# EAGLE board video-max5 (EAGLE 5.11)
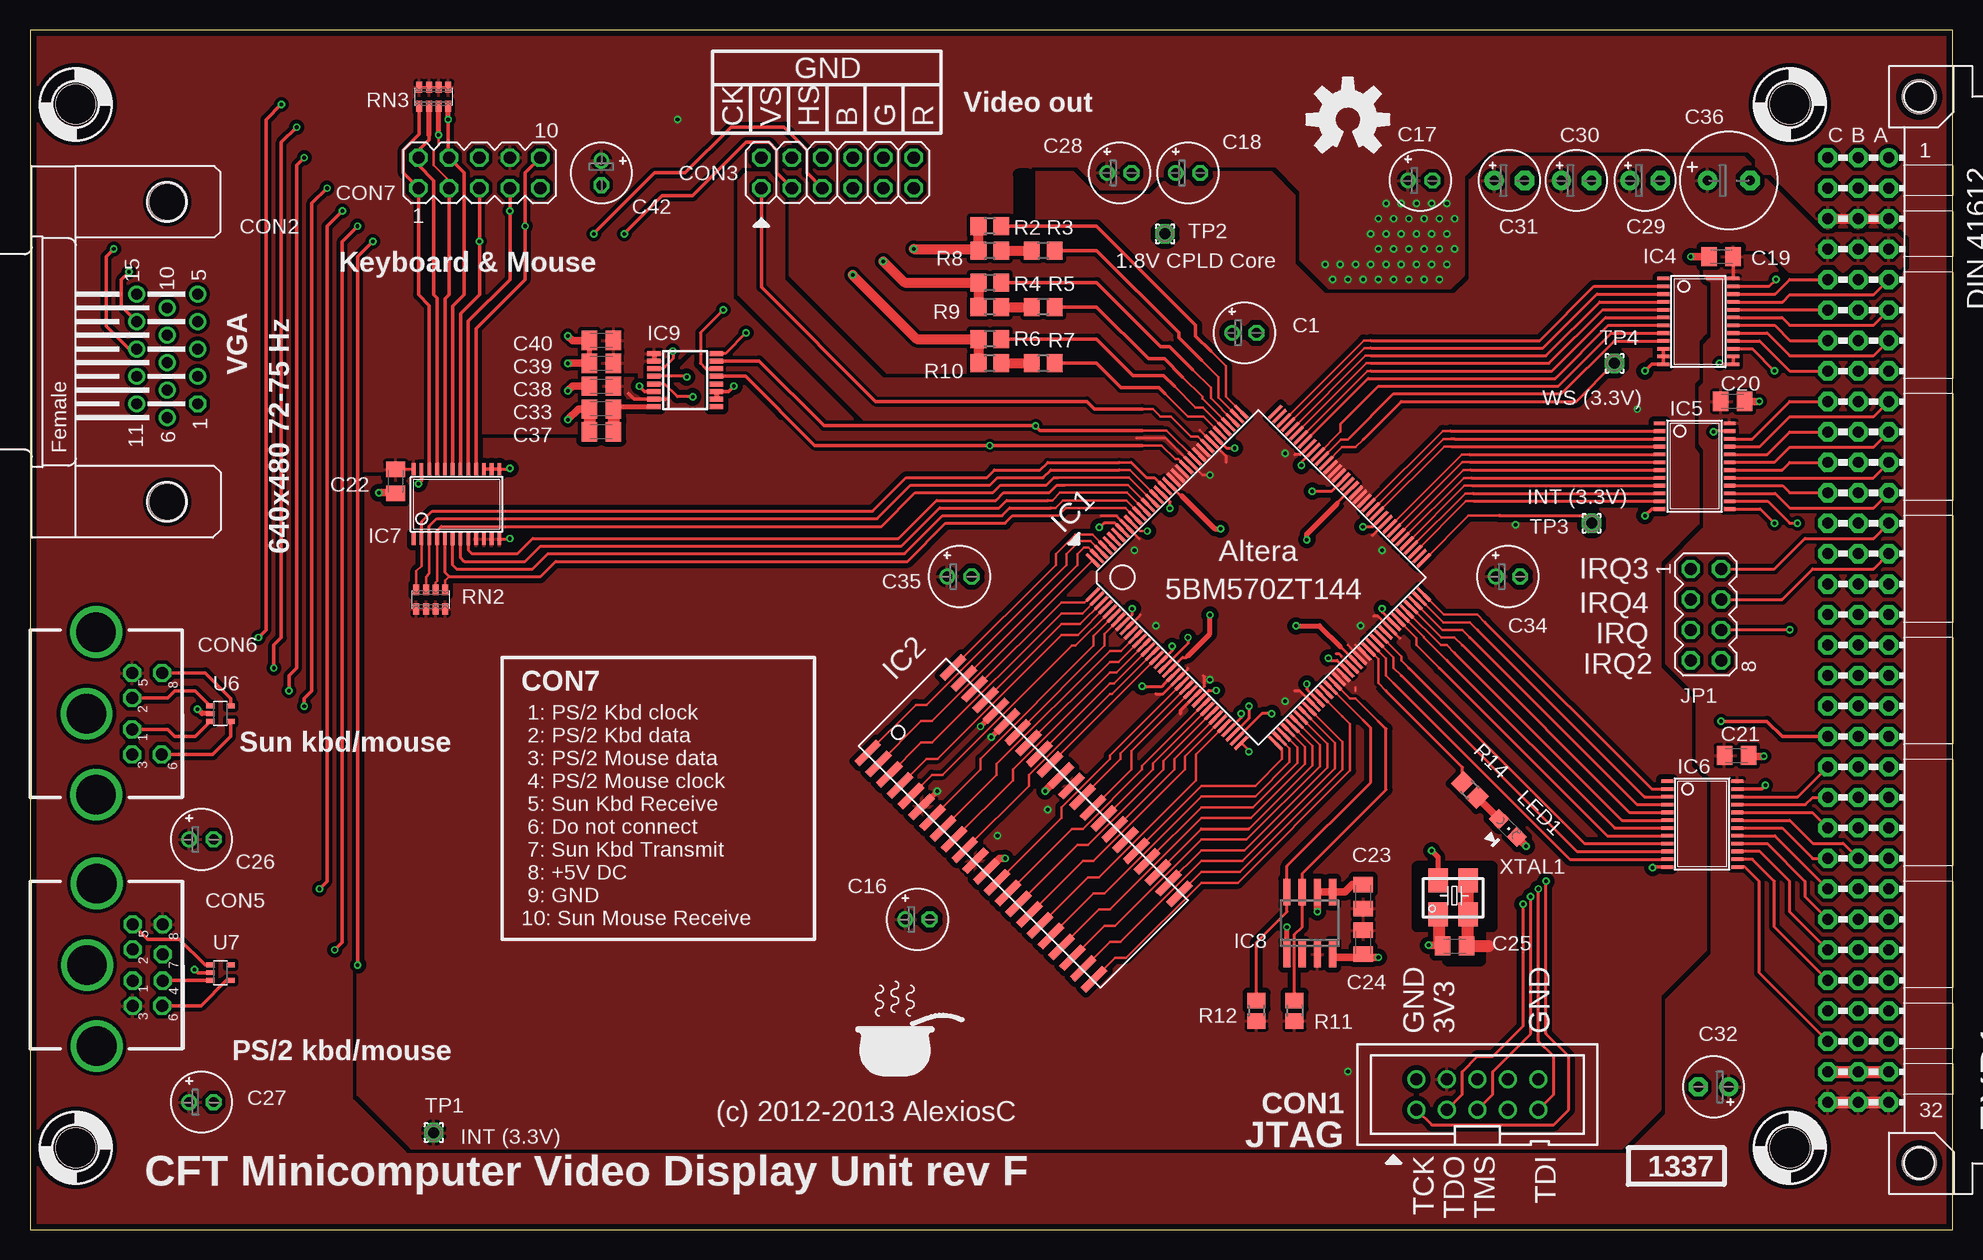
[diagram p5: board, top side]
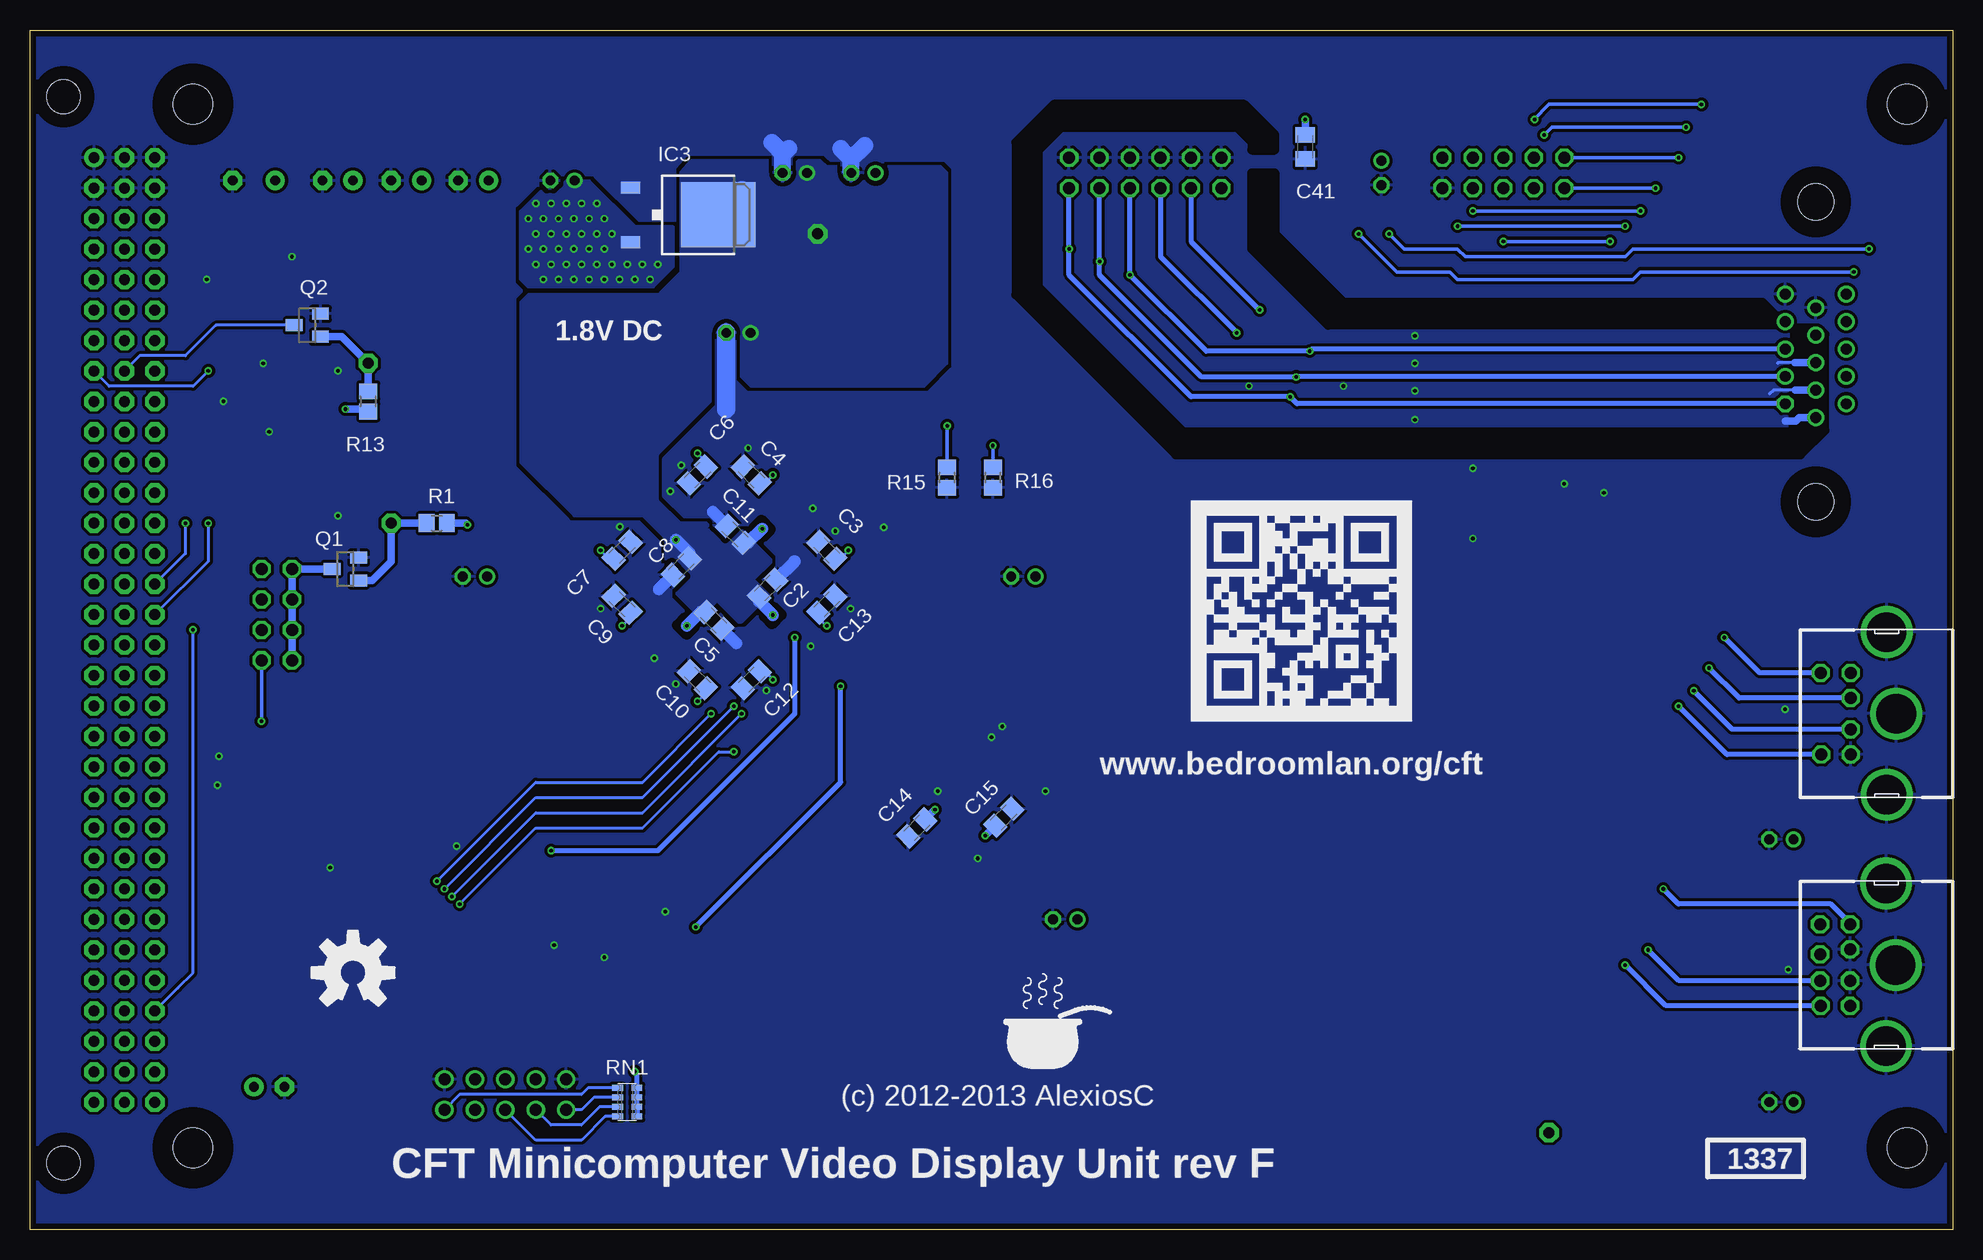
[diagram p6: board, bottom side, seen from below]

Size 160.27 x 100.03 mm. Coordinates in mm from the lower left corner, seen from the top.
Copper layers (1*16): Top 0.035mm / dielectric 1.5mm / Bottom 0.035mm
Design rules "smart-prototyping *": minimum track width 7mil, minimum drill 12mil, track to track 5mil, track to pad 5mil, pad to pad 5mil, via to via 5mil, smd to smd 0mil, copper to edge 20mil, drill to drill 10mil, minimum pad ring 10mil, minimum via ring 6mil, stop-mask expansion 2mil, vias tented up to drill 25mil, thermal gap 10mil
Net classes: 0 default: width 0.254 mm, clearance 0.152 mm; 1 low power: width 1.27 mm, clearance 0.203 mm; 2 Power Rail: width 0.61 mm, clearance 0.254 mm; 3 3.3V power: width 0.61 mm, clearance 0.203 mm; 4 Analogue: width 0.406 mm, clearance 0.203 mm
tRestrict: area 115.6,25.2 to 121.6,30; area 118.1,22.4 to 121,26.2; area 115.6,25.6 to 121.6,30.3; area 115.9,25.2 to 121.9,30; area 115.9,25.6 to 121.9,30.3; area 82.4,84.4 to 83.2,88
bRestrict: area 14,75.4 to 58.4,88.1; area 10.7,64.6 to 78.1,93.8; area 98.6,57.8 to 99.9,59.2; area 104.9,49.6 to 106.3,51; area 97.7,50.5 to 99.1,51.9

## Footprints (pad centres in the part's own frame; a part is rotated, then mirrored left to right if it is on the bottom)
E2-5 = drill 0.813 pad 1.27 round: + -1.016,0 | drill 0.813 pad 1.27 octagon: - 1.016,0
C0805K = smd 1.3 x 1.6: 1 -1,0; 2 1,0
E2,5-5 = drill 0.813 pad 1.6 round: + -1.27,0 | drill 0.813 pad 1.6 octagon: - 1.27,0
E3,5-8 = drill 0.813 pad 1.6 round: + -1.778,0 | drill 0.813 pad 1.6 octagon: - 1.778,0
SHROUDED-HEADER-2X5-2.5MM = drill 1 pad 1.422 round: 1 -5.08,-1.27; 2 -5.08,1.27; 3 -2.54,-1.27; 4 -2.54,1.27; 5 0,-1.27; 6 0,1.27; 7 2.54,-1.27; 8 2.54,1.27; 9 5.08,-1.27; 10 5.08,1.27
HDF15H = drill 0.9 octagon: 1 4.329,2.54 | drill 0.9 round: 2 2.043,2.54; 3 -0.243,2.54; 4 -2.529,2.54; 5 -4.815,2.54; 6 5.472,0; 7 3.186,0; 8 0.9,0; 9 -1.386,0; 10 -3.672,0; 11 4.329,-2.54; 12 2.043,-2.54; 13 -0.243,-2.54; 14 -2.529,-2.54; 15 -4.815,-2.54 | hole 3: -12.5,0; 12.5,0
2X06 = drill 1.016 octagon: 1 -6.35,-1.27; 2 -6.35,1.27; 3 -3.81,-1.27; 4 -3.81,1.27; 5 -1.27,-1.27; 6 -1.27,1.27; 7 1.27,-1.27; 8 1.27,1.27; 9 3.81,-1.27; 10 3.81,1.27; 11 6.35,-1.27; 12 6.35,1.27
M_DIN8 = drill 1 pad 1.422 octagon: 1 -1.3,-3.8; 2 1.3,-3.8; 3 -3.4,-3.8; 4 -1.3,-6.3; 5 3.4,-3.8; 6 -3.4,-6.25; 7 0.9,-6.3; 8 3.4,-6.3 | drill 3.3 pad 3.5 round: SH1 6.8,-0.8; SH2 0,0; SH3 -6.75,-0.8
M_DIN6 = drill 1 pad 1.422 octagon: 1 -1.3,-3.75; 2 1.3,-3.75; 3 -3.4,-3.75; 5 3.4,-3.75; 6 -3.4,-6.2; 8 3.4,-6.25 | drill 3.3 pad 3.5 round: SH1 6.8,-0.75; SH2 0,0.05; SH3 -6.75,-0.75
MA05-2 = drill 1.016 octagon: 1 -5.08,-1.27; 2 -5.08,1.27; 3 -2.54,-1.27; 4 -2.54,1.27; 5 0,-1.27; 6 0,1.27; 7 2.54,-1.27; 8 2.54,1.27; 9 5.08,-1.27; 10 5.08,1.27
VG96K = drill 0.914 pad 1.6 round: A1 154.94,39.37 | drill 0.914 pad 1.6 octagon: A2 154.94,36.83; A3 154.94,34.29; A4 154.94,31.75; A5 154.94,29.21; A6 154.94,26.67; A7 154.94,24.13; A8 154.94,21.59; A9 154.94,19.05; A10 154.94,16.51; A11 154.94,13.97; A12 154.94,11.43; A13 154.94,8.89; A14 154.94,6.35; A15 154.94,3.81; A16 154.94,1.27; A17 154.94,-1.27; A18 154.94,-3.81; A19 154.94,-6.35; A20 154.94,-8.89; A21 154.94,-11.43; A22 154.94,-13.97; A23 154.94,-16.51; A24 154.94,-19.05; A25 154.94,-21.59; A26 154.94,-24.13; A27 154.94,-26.67; A28 154.94,-29.21; A29 154.94,-31.75; A30 154.94,-34.29; A31 154.94,-36.83; A32 154.94,-39.37; B1 152.4,39.37; B2 152.4,36.83; B3 152.4,34.29; B4 152.4,31.75; B5 152.4,29.21; B6 152.4,26.67; B7 152.4,24.13; B8 152.4,21.59; B9 152.4,19.05; B10 152.4,16.51; B11 152.4,13.97; B12 152.4,11.43; B13 152.4,8.89; B14 152.4,6.35; B15 152.4,3.81; B16 152.4,1.27; B17 152.4,-1.27; B18 152.4,-3.81; B19 152.4,-6.35; B20 152.4,-8.89; B21 152.4,-11.43; B22 152.4,-13.97; B23 152.4,-16.51; B24 152.4,-19.05; B25 152.4,-21.59; B26 152.4,-24.13; B27 152.4,-26.67; B28 152.4,-29.21; B29 152.4,-31.75; B30 152.4,-34.29; B31 152.4,-36.83; B32 152.4,-39.37; C1 149.86,39.37; C2 149.86,36.83; C3 149.86,34.29; C4 149.86,31.75; C5 149.86,29.21; C6 149.86,26.67; C7 149.86,24.13; C8 149.86,21.59; C9 149.86,19.05; C10 149.86,16.51; C11 149.86,13.97; C12 149.86,11.43; C13 149.86,8.89; C14 149.86,6.35; C15 149.86,3.81; C16 149.86,1.27; C17 149.86,-1.27; C18 149.86,-3.81; C19 149.86,-6.35; C20 149.86,-8.89; C21 149.86,-11.43; C22 149.86,-13.97; C23 149.86,-16.51; C24 149.86,-19.05; C25 149.86,-21.59; C26 149.86,-24.13; C27 149.86,-26.67; C28 149.86,-29.21; C29 149.86,-31.75; C30 149.86,-34.29; C31 149.86,-36.83; C32 149.86,-39.37 | hole 2.794: 157.48,44.45; 157.48,-44.45
TQFP144 = smd 0.27 x 1.5: 1 -8.75,-10.75; 2 -8.25,-10.75; 3 -7.75,-10.75; 4 -7.25,-10.75; 5 -6.75,-10.75; 6 -6.25,-10.75; 7 -5.75,-10.75; 8 -5.25,-10.75; 9 -4.75,-10.75; 10 -4.25,-10.75; 11 -3.75,-10.75; 12 -3.25,-10.75; 13 -2.75,-10.75; 14 -2.25,-10.75; 15 -1.75,-10.75; 16 -1.25,-10.75; 17 -0.75,-10.75; 18 -0.25,-10.75; 19 0.25,-10.75; 20 0.75,-10.75; 21 1.25,-10.75; 22 1.75,-10.75; 23 2.25,-10.75; 24 2.75,-10.75; 25 3.25,-10.75; 26 3.75,-10.75; 27 4.25,-10.75; 28 4.75,-10.75; 29 5.25,-10.75; 30 5.75,-10.75; 31 6.25,-10.75; 32 6.75,-10.75; 33 7.25,-10.75; 34 7.75,-10.75; 35 8.25,-10.75; 36 8.75,-10.75; 73 8.75,10.75; 74 8.25,10.75; 75 7.75,10.75; 76 7.25,10.75; 77 6.75,10.75; 78 6.25,10.75; 79 5.75,10.75; 80 5.25,10.75; 81 4.75,10.75; 82 4.25,10.75; 83 3.75,10.75; 84 3.25,10.75; 85 2.75,10.75; 86 2.25,10.75; 87 1.75,10.75; 88 1.25,10.75; 89 0.75,10.75; 90 0.25,10.75; 91 -0.25,10.75; 92 -0.75,10.75; 93 -1.25,10.75; 94 -1.75,10.75; 95 -2.25,10.75; 96 -2.75,10.75; 97 -3.25,10.75; 98 -3.75,10.75; 99 -4.25,10.75; 100 -4.75,10.75; 101 -5.25,10.75; 102 -5.75,10.75; 103 -6.25,10.75; 104 -6.75,10.75; 105 -7.25,10.75; 106 -7.75,10.75; 107 -8.25,10.75; 108 -8.75,10.75 | smd 1.5 x 0.27: 37 10.75,-8.75; 38 10.75,-8.25; 39 10.75,-7.75; 40 10.75,-7.25; 41 10.75,-6.75; 42 10.75,-6.25; 43 10.75,-5.75; 44 10.75,-5.25; 45 10.75,-4.75; 46 10.75,-4.25; 47 10.75,-3.75; 48 10.75,-3.25; 49 10.75,-2.75; 50 10.75,-2.25; 51 10.75,-1.75; 52 10.75,-1.25; 53 10.75,-0.75; 54 10.75,-0.25; 55 10.75,0.25; 56 10.75,0.75; 57 10.75,1.25; 58 10.75,1.75; 59 10.75,2.25; 60 10.75,2.75; 61 10.75,3.25; 62 10.75,3.75; 63 10.75,4.25; 64 10.75,4.75; 65 10.75,5.25; 66 10.75,5.75; 67 10.75,6.25; 68 10.75,6.75; 69 10.75,7.25; 70 10.75,7.75; 71 10.75,8.25; 72 10.75,8.75; 109 -10.75,8.75; 110 -10.75,8.25; 111 -10.75,7.75; 112 -10.75,7.25; 113 -10.75,6.75; 114 -10.75,6.25; 115 -10.75,5.75; 116 -10.75,5.25; 117 -10.75,4.75; 118 -10.75,4.25; 119 -10.75,3.75; 120 -10.75,3.25; 121 -10.75,2.75; 122 -10.75,2.25; 123 -10.75,1.75; 124 -10.75,1.25; 125 -10.75,0.75; 126 -10.75,0.25; 127 -10.75,-0.25; 128 -10.75,-0.75; 129 -10.75,-1.25; 130 -10.75,-1.75; 131 -10.75,-2.25; 132 -10.75,-2.75; 133 -10.75,-3.25; 134 -10.75,-3.75; 135 -10.75,-4.25; 136 -10.75,-4.75; 137 -10.75,-5.25; 138 -10.75,-5.75; 139 -10.75,-6.25; 140 -10.75,-6.75; 141 -10.75,-7.25; 142 -10.75,-7.75; 143 -10.75,-8.25; 144 -10.75,-8.75
SOJ44-4 = smd 0.635 x 2.54: 1 -13.335,-5.029; 2 -12.065,-5.029; 3 -10.795,-5.029; 4 -9.525,-5.029; 5 -8.255,-5.029; 6 -6.985,-5.029; 7 -5.715,-5.029; 8 -4.445,-5.029; 9 -3.175,-5.029; 10 -1.905,-5.029; 11 -0.635,-5.029; 12 0.635,-5.029; 13 1.905,-5.029; 14 3.175,-5.029; 15 4.445,-5.029; 16 5.715,-5.029; 17 6.985,-5.029; 18 8.255,-5.029; 19 9.525,-5.029; 20 10.795,-5.029; 21 12.065,-5.029; 22 13.335,-5.029; 23 13.335,5.029; 24 12.065,5.029; 25 10.795,5.029; 26 9.525,5.029; 27 8.255,5.029; 28 6.985,5.029; 29 5.715,5.029; 30 4.445,5.029; 31 3.175,5.029; 32 1.905,5.029; 33 0.635,5.029; 34 -0.635,5.029; 35 -1.905,5.029; 36 -3.175,5.029; 37 -4.445,5.029; 38 -5.715,5.029; 39 -6.985,5.029; 40 -8.255,5.029; 41 -9.525,5.029; 42 -10.795,5.029; 43 -12.065,5.029; 44 -13.335,5.029
TO252 = smd 1 x 1.6: 1 -2.28,-4.8; 2 2.28,-4.8 | smd 5.4 x 6.2: 3 0,2.5
TSSOP24@1 = smd 0.305 x 0.991: 1 -3.575,-2.918; 2 -2.925,-2.918; 3 -2.275,-2.918; 4 -1.625,-2.918; 5 -0.975,-2.918; 6 -0.325,-2.918; 7 0.325,-2.918; 8 0.975,-2.918; 9 1.625,-2.918; 10 2.275,-2.918; 11 2.925,-2.918; 12 3.575,-2.918; 13 3.575,2.918; 14 2.925,2.918; 15 2.275,2.918; 16 1.625,2.918; 17 0.975,2.918; 18 0.325,2.918; 19 -0.325,2.918; 20 -0.975,2.918; 21 -1.625,2.918; 22 -2.275,2.918; 23 -2.925,2.918; 24 -3.575,2.918
SO08 = smd 0.6 x 2.2: 1 -1.905,-2.6; 2 -0.635,-2.6; 3 0.635,-2.6; 4 1.905,-2.6; 5 1.905,2.6; 6 0.635,2.6; 7 -0.635,2.6; 8 -1.905,2.6
SSOP16 = smd 0.419 x 1.143: 1 -2.223,-2.6; 2 -1.587,-2.6; 3 -0.953,-2.6; 4 -0.318,-2.6; 5 0.318,-2.6; 6 0.953,-2.6; 7 1.587,-2.6; 8 2.223,-2.6; 9 2.223,2.6; 10 1.587,2.6; 11 0.953,2.6; 12 0.318,2.6; 13 -0.318,2.6; 14 -0.953,2.6; 15 -1.587,2.6; 16 -2.223,2.6
MA04-2 = drill 1.016 octagon: 1 -3.81,-1.27; 2 -3.81,1.27; 3 -1.27,-1.27; 4 -1.27,1.27; 5 1.27,-1.27; 6 1.27,1.27; 7 3.81,-1.27; 8 3.81,1.27
CHIPLED_0805 = smd 1.2 x 1.2: A 0,-1.05; C 0,1.05
SOT23 = smd 1 x 1.4: 1 -0.95,-1.1; 2 0.95,-1.1; 3 0,1.1
R0805 = smd 1.3 x 1.5: 1 -0.85,0; 2 0.85,0
R0805' = smd 1.3 x 1.5: 1 -0.95,0; 2 0.95,0
CTS742C083 = smd 0.5 x 0.9: 1 -1.2,-0.8; 2 -0.4,-0.8; 3 0.4,-0.8; 4 1.2,-0.8; 5 1.2,0.8; 6 0.4,0.8; 7 -0.4,0.8; 8 -1.2,0.8
1,6/0,9 = drill 0.914 pad 1.6 octagon: 1 0,0
STANDOFF_28_60 = hole 3.302: 0,0
SC70-5 = smd 0.4 x 0.7: 1 -0.65,-0.85; 2 0,-0.85; 3 0.65,-0.85; 4 0.65,0.85; 5 -0.65,0.85
CRYSTAL-SMD-5X3.2MM = smd 1.6 x 2: 1 1.125,-1.475; 2 -1.375,-1.475; 3 -1.375,1.35; 4 1.125,1.35

## Placement (x,y rotation side)
$4_37_$1  SIGNATURESILK  [SIGNATURE]  78.74,13.18 0 bottom
$4_39_$  OSHW-LOGOL  [OSHW-LOGO-L]  109.86,92.56 0 top
$4_39_$1  OSHW-LOGOL  [OSHW-LOGO-L]  133.35,21.44 0 bottom
$4_40_$  QRCODE-CFT  [CFT-QRCODE]  63.5,42.39 0 bottom
C1  47uF  [E2-5]  101.22,74.78 0 top
C2  0.1uF  [C0805K]  98.8,53.5 225 bottom
C3  0.1uF  [C0805K]  93.86,56.64 315 bottom
C4  0.1uF  [C0805K]  100.14,62.92 135 bottom
C5  0.1uF  [C0805K]  103.29,50.8 135 bottom
C6  0.1uF  [C0805K]  104.63,62.92 45 bottom
C7  0.1uF  [C0805K]  110.92,56.64 45 bottom
C8  0.1uF  [C0805K]  105.98,55.29 45 bottom
C9  0.1uF  [C0805K]  110.92,52.15 315 bottom
C10  0.1uF  [C0805K]  104.63,45.86 135 bottom
C11  0.1uF  [C0805K]  101.49,57.99 315 bottom
C12  0.1uF  [C0805K]  100.14,45.86 45 bottom
C13  0.1uF  [C0805K]  93.86,52.15 45 bottom
C14  0.1uF  [C0805K]  86.36,33.5 225 bottom
C15  0.1uF  [C0805K]  79.12,34.39 45 bottom
C16  47uF  [E2-5]  73.98,25.88 0 top
C17  10uF  [E2-5]  115.89,87.48 0 top
C18  22uF  [E2-5]  96.52,88.11 0 top
C19  0.1uF  [C0805K]  140.97,81.13 180 top
C20  0.1uF  [C0805K]  141.92,69.06 0 top
C21  0.1uF  [C0805K]  142.24,39.54 0 top
C22  0.1uF  [C0805K]  30.48,62.4 270 top
C23  1uF  [C0805K]  111.12,27.79 90 top
C24  0.1uF  [C0805K]  111.12,23.98 270 top
C25  0.1uF  [C0805K]  118.75,23.66 0 top
C26  22uF  [E2-5]  14.29,32.55 0 top
C27  22uF  [E2-5]  14.29,10.64 0 top
C28  22uF  [E2-5]  90.81,88.11 0 top
C29  1uF  [E2,5-5]  134.62,87.48 0 top
C30  1uF  [E2,5-5]  128.91,87.48 0 top
C31  1uF  [E2,5-5]  123.32,87.48 0 top
C32  1uF  [E2,5-5]  140.34,11.91 180 top
C33  0.1uF  [C0805K]  47.62,68.43 180 top
C34  47uF  [E2-5]  123.19,54.46 0 top
C35  47uF  [E2-5]  77.47,54.46 0 top
C36  47uF  [E3,5-8]  141.6,87.48 0 top
C37  0.1uF  [C0805K]  47.62,66.52 180 top
C38  0.1uF  [C0805K]  47.62,70.33 180 top
C39  0.1uF  [C0805K]  47.62,72.24 180 top
C40  0.1uF  [C0805K]  47.62,74.14 180 top
C41  0.1uF  [C0805K]  53.98,90.27 270 bottom
C42  47uF  [E2-5]  47.62,88.11 270 top
CON1  JTAG-ALTERA  [SHROUDED-HEADER-2X5-2.5MM]  120.65,11.28 0 top
CON2  [HDF15H]  11.43,73.19 270 top
CON3  [2X06]  67.31,88.11 180 top
CON5  [M_DIN8]  4.76,22.07 90 top
CON6  [M_DIN6]  4.76,43.03 90 top
CON7  [MA05-2]  37.47,88.11 0 top
EXP1  [VG96K]  0,50.01 0 top
IC1  5M570ZT144  [TQFP144]  102.39,54.39 315 top
IC2  AS7C34098A  [SOJ44-4]  82.82,33.88 315 top
IC3  AP1117D18  [TO252]  105.41,84.62 270 bottom
IC4  IDTQS3861PA  [TSSOP24@1]  139.06,75.73 270 top
IC5  IDTQS3861PA  [TSSOP24@1]  138.75,63.67 270 top
IC6  IDTQS3861PA  [TSSOP24@1]  139.38,33.82 270 top
IC7  IDTQS3861PA  [TSSOP24@1]  35.56,60.49 0 top
IC8  DS1085L  [SO08]  106.68,25.57 0 top
IC9  TPDS7019-15DBQR  [SSOP16]  54.61,70.84 270 top
JP1  [MA04-2]  139.7,51.28 270 top
LED1  LED-5MM-GREEN  [CHIPLED_0805]  123.19,33.5 225 top
Q1  BSS138  [SOT23]  133.99,55.09 90 bottom
Q2  BSS138  [SOT23]  137.16,75.41 90 bottom
R1  4k7  [R0805]  126.36,58.9 0 bottom
R2  412R  [R0805']  80.01,83.67 180 top
R3  412R  [R0805']  84.45,81.64 180 top
R4  412R  [R0805']  80.01,78.97 180 top
R5  412R  [R0805']  84.45,76.94 180 top
R6  412R  [R0805']  80.01,74.27 180 top
R7  412R  [R0805']  84.45,72.24 180 top
R8  412R  [R0805']  80.01,81.64 180 top
R9  412R  [R0805']  80.01,76.94 180 top
R10  412R  [R0805']  80.01,72.24 180 top
R11  4k7  [R0805]  105.41,18.26 270 top
R12  4k7  [R0805]  102.23,18.26 270 top
R13  4k7  [R0805]  132.08,69.06 270 bottom
R14  330R  [R0805]  120.02,36.68 315 top
R15  4k7  [R0805]  83.82,62.71 90 bottom
R16  4k7  [R0805]  80.01,62.71 90 bottom
RN1  4.7k  [CTS742C083]  110.49,10.64 270 bottom
RN2  4.7k  [CTS742C083]  33.4,52.55 180 top
RN3  4.7k  [CTS742C083]  33.66,94.46 0 top
TP1  [1,6/0,9]  33.66,8.1 0 top
TP2  [1,6/0,9]  94.61,83.03 0 top
TP3  [1,6/0,9]  130.18,58.9 180 top
TP4  [1,6/0,9]  132.08,72.24 0 top
U1  HOLE  [STANDOFF_28_60]  3.81,93.83 0 top
U2  HOLE  [STANDOFF_28_60]  3.81,6.83 0 top
U3  HOLE  [STANDOFF_28_60]  146.69,93.83 0 top
U4  HOLE  [STANDOFF_28_60]  146.69,6.83 0 top
U6  BZA856AVL  [SC70-5]  15.88,43.03 270 top
U7  BZA856AVL  [SC70-5]  15.88,21.44 270 top
U$1  SIGNATURESILK  [SIGNATURE]  69.22,12.55 0 top
XTAL1  64.000  [CRYSTAL-SMD-5X3.2MM]  118.75,27.79 0 top

## Tracks (layer width: path | path; a pad name or v marks a point on that pad's centre or on a via)
!IODEV1XX
  Top 0.254: IC6.19 146.68,34.15 148.59,32.23 151.13,32.23 EXP1.B24
!IODEV1XX-3V3
  Top 0.203: IC1.69 117.66,49.38 118.75,49.38 119.38,48.74
  Top 0.254: 119.38,48.74 133.33,34.79 IC6.5
!IRQ  (via drill 0.3)
  Top 0.254: v146.69,50.01 JP1.6
  Bottom 0.254: v146.69,50.01 146.69,21.44 147.96,20.17 EXP1.C29
!IRQ2  (via drill 0.3)
  Top 0.305: v140.97,42.39 144.78,42.39 146.05,41.12 EXP1.C20
  Bottom 0.305: v140.97,42.39 JP1.8
!IRQ3
  Top 0.254: JP1.2 145.41,55.09 147.96,57.63 153.67,57.63 EXP1.A13
!IRQ4
  Top 0.254: JP1.4 146.05,52.55 148.59,55.09 153.67,55.09 EXP1.A14
!PR
  Top 0.203: IC2.41 85.96,50.49 87.53,50.49 IC1.3
!PW
  Top 0.203: IC1.32 97.19,39.65 97.19,37.47 89.11,29.39 88.21,29.39 IC2.17
!R  (via drill 0.3)
  Top 0.254: IC5.14 144.85,60.74 146.69,58.9 v147.32,58.9
  Bottom 0.254: v147.32,58.9 147.32,56.36 EXP1.C15
!R-3V3
  Top 0.203: IC1.76 119.64,61.39 120.27,61.39
  Top 0.254: 120.27,61.39 IC5.10
!RESET
  Top 0.254: IC6.13 142.96,30.24 144.15,29.06 144.15,21.44 EXP1.C30
!RESET-3V3
  Top 0.203: IC1.60 113.03,47.64 113.03,46.2 113.67,45.57
  Top 0.254: IC6.11 128.34,30.9 113.67,45.57
!W  (via drill 0.3)
  Top 0.254: IC5.13 144.23,60.09 v145.41,58.9
  Bottom 0.254: v145.41,58.9 145.41,55.73 EXP1.C16
!W-3V3
  Top 0.203: IC1.75 119.69,60.74 120.33,60.74
  Top 0.254: 120.33,60.74 IC5.11
!WS
  Bottom 0.254: Q2.3 144.78,75.41 147.32,72.87 151.13,72.87 EXP1.B8
+3V3  (via drill 0.3)
  Top 0.203: IC1.25 97.9,45.31 | 97.9,45.31 | IC1.58 111.2,48.03 110.49,48.74 | IC1.57 110.87,47.72 109.86,48.74 | 110.49,45.23 110.49,44.93 | v98.35,62.92 97.75,62.92 IC1.121 94.66,66.01 92.24,66.01 | IC1.116 97.54,66.67
  Top 0.254: 111.89,57.88 IC1.82 | 114.19,49.31 IC1.64 112.34,51.16 112.01,51.16 | IC1.136 92.48,57.59 | IC1.9 92.55,51.27 | IC1.100 105.89,64.62 105.41,64.62 | IC1.116 99.69,64.51 99.69,63.98 | 93.85,44.68 94.44,44.68 IC1.21 96.52,46.76 96.52,46.84 | IC1.46 105.84,44.93 105.41,44.93 | 109.3,47.83 109.1,48.03 108.88,48.03 | 97.9,45.31 97.9,46.09 97.79,46.2 | 91.59,58.48 90.53,59.54 89.28,59.54
  Top 0.305: XTAL1.1 119.87,24.12 120.02,23.98 | IC1.25 95.89,43.29 95.89,43.03 | 53.03,69.25 IC9.7 50.35,69.25 49.91,69.7
  Top 1.016: XTAL1.4 XTAL1.1 119.87,23.78 C25.2 121.6,23.66
  Bottom 0.254: v98.35,45.86 99.06,46.57 C12.2 | C6.2 103.93,64.01 v104.63,64.72 | C9.2 110.21,51.06 v110.92,50.35 | C3.2 92.77,55.93 v92.06,56.64 | C7.1 112.01,55.93 v112.72,56.64 | C10.1 103.93,44.77 v104.63,44.07 | C13.1 94.56,51.06 v93.86,50.35 | C4.1 99.06,62.22 v98.35,62.92 | R13.2 132.29,68.43
  Bottom 0.406: RN1.5 RN1.6 RN1.7 RN1.8 109.69,13.02 v109.86,13.18
  Bottom 0.61: v123.83,58.78 123.95,58.9 R1.2 | 132.29,68.43 v133.99,68.43 | C14.1 v84.84,35.03 | v80.64,32.87 C15.1
  pour Top (isolate 0.406, rank 2): 27.3,62.71 27.3,11.28 31.75,6.83 132.72,6.83 135.89,10.01 135.89,19.53 139.7,23.34 139.7,37.31 138.43,38.58 138.43,44.3 135.89,46.84 135.89,55.73 139.06,58.9 139.06,64.62 138.68,65.13 138.68,70.59 139.06,70.97 139.06,74.14 139.7,74.78 139.7,78.59 139.06,79.22 139.06,80.49 140.34,81.76 144.78,81.76 146.69,79.86 155.57,79.86 156.21,80.49 156.21,82.4 155.57,83.03 149.22,83.03 142.88,89.38 121.92,89.38 120.02,87.48 120.02,79.22 118.75,77.95 107.95,77.95 105.41,80.49 105.41,86.21 103.5,88.11 97.79,88.11 97.16,87.48 94.61,87.48 93.34,86.21 88.9,86.21 87,88.11 76.2,88.11 74.93,89.38 62.87,89.38 62.87,87.48 62.23,86.84 56.52,86.84 55.88,86.21 55.88,73.51 53.34,70.97 46.35,70.97 46.35,65.89 36.2,65.89 33.02,62.71
  pour Top (isolate 0.254, no thermals): 97.16,66.52 95.89,65.25 97.79,63.35 99.31,64.87 97.66,66.52
  pour Top (isolate 0.254, rank 2, no thermals): 107.44,62.71 109.86,60.17 110.49,60.05 112.39,61.95 109.86,64.62 109.47,64.62
  pour Top (isolate 0.254, no thermals): 98.42,63.35 95.25,66.52 85.09,66.52 84.45,67.16 66.67,67.16 61.59,72.24 57.15,72.24 57.15,70.97 59.05,70.97 66.04,63.98 90.81,63.98 95.25,60.81 95.89,60.81
  pour Top (isolate 0.254, rank 2, no thermals): 107.82,46.46 110.74,49.25 112.39,47.47 112.39,45.44 110.87,43.92 110.49,44.3 109.98,44.3
  pour Top (isolate 0.254): 59.69,88.11 61.59,88.11 62.87,86.84 62.87,79.22 71.12,70.97 89.53,70.97 90.81,69.7 93.98,69.7 95.89,67.79 97.79,67.79 99.69,65.89 98.42,64.62 97.66,63.73 94.61,66.78 94.61,67.16 69.85,67.16 59.05,77.95 59.05,87.48
+12V
  Top 1.016: EXP1.C31 EXP1.B31 EXP1.A31
AB0
  Top 0.254: IC4.21 146.09,77.36 146.69,77.95 153.67,77.95 EXP1.A5
AB0-3V3
  Top 0.203: IC1.105 111.25,73.51 111.76,73.51
  Top 0.254: 111.76,73.51 126.11,73.51 130.61,78 IC4.3
AB1
  Top 0.254: IC4.19 146.04,76.06 146.69,75.41 153.67,75.41 EXP1.A6
AB1-3V3
  Top 0.203: IC1.103 111.39,72.24 111.76,72.24
  Top 0.254: 111.76,72.24 126.62,72.24 131.09,76.7 IC4.5
AB2
  Top 0.254: IC4.17 144.8,74.75 146.69,72.87 153.67,72.87 EXP1.A7
AB2-3V3
  Top 0.254: IC1.101 111.54,70.97 127.13,70.97 131.56,75.4 IC4.7
AB3  (via drill 0.3)
  Top 0.254: IC4.15 143.56,73.45 v145.41,71.6
  Bottom 0.254: v145.41,71.6 146.69,70.33 153.67,70.33 EXP1.A8
AB3-3V3
  Top 0.203: IC1.97 109.29,65.89 109.86,65.89 109.98,66.01
  Top 0.254: IC4.9 132.04,74.11 127.64,69.7 113.67,69.7 109.98,66.01
AB4
  Top 0.254: IC5.21 144.18,65.29 146.69,67.79 153.67,67.79 EXP1.A9
AB4-3V3
  Top 0.203: IC1.85 117.82,65.94 118.75,65.94
  Top 0.254: 118.46,65.94 118.75,65.94 IC5.3
AB5
  Top 0.254: IC5.19 145.42,63.99 146.69,65.25 153.67,65.25 EXP1.A10
AB5-3V3
  Top 0.203: IC1.81 119.35,64.64 119.99,64.64
  Top 0.254: 119.99,64.64 IC5.5
AB6
  Top 0.254: IC5.17 153.65,62.69 EXP1.A11
AB6-3V3
  Top 0.203: IC1.79 119.47,63.34 120.1,63.34
  Top 0.254: 120.1,63.34 IC5.7
AB7
  Top 0.254: IC5.15 145.47,61.39 146.69,60.17 153.67,60.17 EXP1.A12
AB7-3V3
  Top 0.203: IC1.77 119.58,62.04 120.22,62.04
  Top 0.254: 120.22,62.04 IC5.9
B0
  Top 0.203: IC1.113 97.77,68.55 97.16,68.55 95.38,70.33
  Top 0.305: R6.1 88.9,74.27 91.95,71.22 94.49,71.22 95.38,70.33
B1
  Top 0.203: IC1.114 97.83,67.79 96.52,67.79 94.61,69.7
  Top 0.305: R7.1 88.9,72.24 90.93,70.21 94.11,70.21 94.61,69.7
BLUE  (via drill 0.3)
  Top 0.254: IC9.3 52.77,71.79 53.59,72.62 v53.59,73.25
  Top 0.813: R10.2 R6.2 73.91,74.27 v68.58,79.6
  Bottom 0.406: CON2.3 53.41,73.43 v53.59,73.25 62.23,73.25 v68.58,79.6 CON3.6
CG/!P!
  Top 0.203: IC2.44 85.51,55.43 85.51,56.33 87.13,57.95 88.58,57.95 IC1.141
CLK  (via drill 0.3)
  Top 0.254: IC1.18 96.52,48.88 v96.52,49.38
  Top 0.406: v116.84,31.6 117.37,31.07 XTAL1.3
  Bottom 0.406: v96.52,49.38 96.52,43.03 97.16,42.39 107.95,31.6 v116.84,31.6
DB0
  Top 0.254: IC4.22 145.47,78 146.69,79.22 EXP1.C5
DB0-3V3
  Top 0.203: IC1.106 111.18,74.14 111.76,74.14
  Top 0.254: 111.76,74.14 125.86,74.14 130.37,78.65 IC4.2
DB1
  Top 0.254: IC4.20 149.84,76.7 EXP1.C6
DB1-3V3
  Top 0.203: IC1.104 111.32,72.87 111.76,72.87
  Top 0.254: 111.76,72.87 126.36,72.87 130.85,77.36 IC4.4
DB2
  Top 0.254: IC4.18 145.42,75.4 146.69,74.14 EXP1.C7
DB2-3V3
  Top 0.203: IC1.102 111.47,71.6 111.76,71.6
  Top 0.254: 111.76,71.6 126.87,71.6 131.33,76.06 IC4.6
DB3
  Top 0.254: IC4.16 144.18,74.11 146.69,71.6 EXP1.C8
DB3-3V3
  Top 0.203: IC1.98 109.22,66.53 109.22,67.16 109.35,67.28
  Top 0.254: 109.35,67.28 112.39,70.33 127.38,70.33 131.8,74.75 IC4.8
DB4
  Top 0.254: IC5.22 143.56,65.94 146.69,69.06 EXP1.C9
DB4-3V3
  Top 0.203: IC1.86 117.77,66.59 118.4,66.59
  Top 0.254: 118.4,66.59 IC5.2
DB5
  Top 0.254: IC5.20 144.8,64.64 146.69,66.52 EXP1.C10
DB5-3V3
  Top 0.203: IC1.84 117.88,65.29 118.52,65.29
  Top 0.254: 118.52,65.29 IC5.4
DB6
  Top 0.254: IC5.18 146.04,63.34 146.69,63.98 EXP1.C11
DB6-3V3
  Top 0.203: IC1.80 119.41,63.99 120.05,63.99
  Top 0.254: 120.05,63.99 IC5.6
DB7
  Top 0.254: IC5.16 146.09,62.04 146.69,61.44 EXP1.C12
DB7-3V3
  Top 0.203: IC1.78 119.52,62.69 120.16,62.69
  Top 0.254: 120.16,62.69 IC5.8
DB8
  Top 0.254: 149.81,38.64 EXP1.C21 147.37,36.09 IC6.22
DB8-3V3
  Top 0.203: IC1.72 117.87,51.28 120.65,51.28 121.28,50.65
  Top 0.254: 121.28,50.65 135.19,36.75 IC6.2
DB9
  Top 0.254: IC6.21 147.99,35.44 148.59,36.04 EXP1.C22
DB9-3V3
  Top 0.203: IC1.71 117.8,50.65 120.02,50.65 120.65,50.01
  Top 0.254: 120.65,50.01 134.57,36.09 IC6.3
DB10
  Top 0.254: IC6.20 148.57,34.79 EXP1.C23
DB10-3V3
  Top 0.203: IC1.70 117.73,50.01 119.38,50.01 120.02,49.38
  Top 0.254: 120.02,49.38 133.95,35.44 IC6.4
DB11
  Top 0.254: IC6.18 146.06,33.5 148.59,30.96 EXP1.C24
DB11-3V3
  Top 0.203: IC1.68 117.59,48.74 118.11,48.74 118.75,48.11
  Top 0.254: 118.75,48.11 132.71,34.15 IC6.6
DB12
  Top 0.254: IC6.17 145.44,32.84 EXP1.C25
DB12-3V3
  Top 0.203: IC1.67 116.2,49.42 116.2,49.38 118.11,47.47
  Top 0.254: 118.11,47.47 132.09,33.5 IC6.7
DB13
  Top 0.254: IC6.16 144.82,32.19 147.96,29.06 147.96,27.79 EXP1.C26
DB13-3V3
  Top 0.203: IC1.66 115.57,49.34 115.57,48.74 117.47,46.84
  Top 0.254: 117.47,46.84 131.47,32.84 IC6.8
DB14
  Top 0.254: IC6.15 144.2,31.54 146.69,29.06 146.69,26.52 EXP1.C27
DB14-3V3
  Top 0.203: IC1.62 114.3,47.79 114.3,47.47 114.94,46.84
  Top 0.254: 114.94,46.84 129.58,32.19 IC6.9
DB15
  Top 0.254: IC6.14 143.58,30.9 145.41,29.06 145.41,25.25 EXP1.C28
DB15-3V3
  Top 0.203: IC1.61 113.67,47.71 113.67,46.84 114.3,46.2
  Top 0.254: 114.3,46.2 128.96,31.54 IC6.10
G0
  Top 0.203: IC1.111 98.42,69.32 98.42,70.21 96.9,71.73
  Top 0.305: R4.1 88.9,78.97 94.23,73.63 95,73.63 96.9,71.73
G1
  Top 0.203: IC1.112 97.72,69.32 97.72,69.44 96.07,71.09
  Top 0.305: R5.1 88.9,76.94 93.22,72.62 94.54,72.62 96.07,71.09
GND  (via drill 0.3)
  Top 0.203: C22.2 30.43,61.44 | 91.73,59.05 IC1.135 92.52,58.26 v93.14,58.26 | IC8.4 108.83,22.72 | C24.2 111.14,22.96 111.14,22.71
  Top 0.254: IC1.115 99.74,65.17 v100.41,65.17 | 105.98,64 IC1.99 | IC1.92 108.51,61.58 v106.89,61.58 | 111.91,58.61 IC1.83 | IC1.65 112.72,51.49 v112.72,51.79 | IC1.47 106.43,45.05 v106.43,45.5 | IC1.26 98.26,44.96 v98.89,44.96 | IC1.8 91.88,51.31 v91.88,51.79 | IC1.17 95.2,48.27 v95.2,48.65 | IC5.23 140.4,66.59 v140.34,66.52 | 105.98,64 | v105.98,63.73 105.98,64 | 111.91,58.61 | v111.1,58.61 111.91,58.61 | IC1.128 95.03,60.7 v95.03,60.14 | IC1.54 108.96,47.47 108.41,47.47 v108.23,47.66 | IC4.23 144.97,78.65 v145.54,79.22 | IC7.13 40.01,63.41 v40.01,63.47 | IC7.12 40.01,57.57 v40.01,57.63 | IC1.137 90.45,58.9 89.53,58.9 89.2,58.57 v89.11,58.57
  Top 0.305: v134.62,71.6 135.17,72.15 IC4.12 IC4.11 IC4.10 | C21.2 143.3,39.47 | v140.84,72.24 140.93,72.15 IC4.13 IC4.14 | IC7.23 32.63,62.45 v32.38,62.2 | IC7.15 IC7.14 IC7.13 | IC6.12 135.3,30.24 v135.25,30.2 | IC5.12 135.17,60.09 v134.62,59.54 | U7.2 13.97,21.44 v13.72,21.69 | IC9.11 58.23,69.89 v58.67,70.33 | v50.8,70.33 51.24,69.89 IC9.6 | IC6.23 144.34,36.75 v144.65,37.06
  Top 0.406: v80.12,41.06 IC2.39 | IC2.6 v75.63,36.57 | IC2.40 v79.23,41.96 | IC9.11 IC9.10 | C39.2 C40.2 | v13.97,43.41 14.35,43.03 U6.2
  Top 0.61: IC2.34 v84.61,36.57 | IC2.12 80.8,30.96 v81.28,30.96 | v107.31,26.52 IC8.6 IC8.5 109.6,28.17 110.22,28.79 C23.2 | 111.14,22.71 v112.39,22.71 | v116.59,23.72 117.68,23.72 | C20.2 v144.15,69.06 | v138.43,81.13 C19.2 | 143.3,39.47 v144.53,39.47 | 30.43,61.44 v29.08,61.44 | 108.83,22.72 110.87,22.72 C24.2 | C33.2 45.72,68.43 v44.83,67.54 | C38.2 45.21,70.33 v44.83,69.95 | C40.2 45.21,74.14 v44.83,74.52 | v44.83,72.24 C39.2 | LED1.C v124.71,31.98 | v124.71,31.98
  Top 1.016: XTAL1.2 117.47,26.21 117.47,23.93 C25.1 117.68,23.72 | C33.2 C37.2
  Bottom 0.254: 13.15,72.29 14.55,72.29 | 13.13,70 14.93,70
  Bottom 0.305: 14.55,72.29 14.61,72.24 | 14.93,70 15.24,69.7
  Bottom 0.406: 13.13,70 13.21,70.08
  Bottom 0.61: CON2.8 13.15,72.29 | CON2.7 13.13,70 | CON2.6 12.77,67.72 13.08,67.41 13.97,67.41
  Bottom 1.016: C11.1 103.38,59.87 | 107.87,53.41 C8.1 | 101.4,48.92 C5.1 | C2.1 96.56,55.73 96.52,55.73
  Bottom 1.422: 91.82,89.26 92.71,90.14 | C28.- 91.82,89.26 | 91.82,89.26 90.68,90.4 | 98.42,90.65 97.54,89.76 | C18.- 97.54,89.64 97.03,90.14
  Bottom 1.524: 102.23,68.43 C1.-
  pour Bottom (isolate 0.254, rank 6): 0,100.02 160.02,100.18 160.02,0.48 0,0.48
  pour Bottom (isolate 0.254, no thermals): 108.58,88.11 111.76,88.11 111.76,86.84 110.49,85.57 108.58,85.57
  pour Top (isolate 0.254): 36.83,58.27 39.37,58.27 39.37,57 36.83,57
  pour Top (isolate 0.254, rank 2, no thermals): 91.31,51.16 92.58,49.89 90.81,48.11 89.53,48.11 89.53,50.01 90.81,51.16
  pour Top (isolate 0.305): 87.63,50.65 89.53,48.74 74.93,34.14 72.39,36.68 74.93,39.22 75.56,39.22 87,50.65
GREEN  (via drill 0.3)
  Top 0.254: IC9.4 54.67,71.16 v54.74,71.09
  Top 0.813: R9.2 R4.2 72.9,78.97 v71.12,80.75
  Bottom 0.406: CON2.2 54.68,71.15 v54.74,71.09 62.61,71.09 71.12,79.6 v71.12,80.75 CON3.4
HS  (via drill 0.3)
  Top 0.203: 92.71,65.38 94.33,65.38 95.47,64.24 95.73,64.24 IC1.122
  Top 0.305: 92.71,65.38 v80.01,65.38 65.41,65.38 59.63,71.16 IC9.13
  Bottom 0.305: v80.01,65.38 R16.2
HS-TTL  (via drill 0.3)
  Top 0.254: IC9.14 56.33,71.79 55.88,72.24 55.88,74.78 v57.78,76.68
  Top 0.305: CON2.14 7.62,76.99 7.62,79.22 v8.26,79.86 | v49.53,83.03 52.7,86.21 55.24,86.21 59.69,90.65 61.59,90.65 62.23,90.02 62.23,88.11 CON3.10
  Bottom 0.305: v8.26,79.86 26.04,79.86 26.67,79.22 41.27,79.22 41.91,79.86 46.35,79.86 v49.53,83.03
  Bottom 0.406: v57.78,76.68 63.5,82.4 CON3.10
INT
  Top 0.203: IC1.73 119.91,59.54 122.56,59.54
  Top 0.254: 122.45,59.54 122.56,59.54 129.54,59.54 TP3.1
  Bottom 0.61: R1.1 TP3.1 130.18,55.73 131.76,54.14 Q1.1
KBCLK
  Top 0.203: 90.81,63.98 91.81,63.98 | IC7.2 32.63,55.34 32.2,54.91 RN2.4
  Top 0.254: IC7.2 32.63,59.03 33.53,59.92 70.23,59.92 73.03,62.71 79.76,62.71 80.39,63.35 84.2,63.35 84.84,63.98 90.81,63.98 | 91.81,63.98 93.08,62.71 93.72,62.71 IC1.127
KBCLK-5V  (via drill 0.3)
  Top 0.305: IC7.22 33.28,77.05 32.38,77.95 CON7.1 31.11,88.11 31.11,90.02 32.45,91.36 RN3.1 | v22.86,43.66 22.86,44.3 23.5,44.93 23.5,85.57 v24.77,86.84 | U6.4 16.73,41.11 15.24,39.63 CON6.6
  Bottom 0.305: v24.77,86.84 CON7.1
  Bottom 0.406: v22.86,43.66 18.82,39.63 CON6.6
KBDAT
  Top 0.203: IC1.129 91.67,63.35 90.81,63.35 | IC7.3 33.28,54.72 33,54.44 RN2.3
  Top 0.254: IC7.3 33.28,58.66 33.91,59.28 70.61,59.28 73.41,62.08 80.01,62.08 80.64,62.71 84.45,62.71 85.09,63.35 90.81,63.35
KBDAT-5V  (via drill 0.3)
  Top 0.305: IC7.21 33.94,77.67 33.66,77.95 33.66,87.48 32.38,88.75 CON7.2 32.38,90.02 33.26,90.89 33.26,91.29 | v21.59,44.93 21.59,46.2 22.23,46.84 22.23,88.75 v22.86,89.38 | CON6.1 11.46,41.73 12.06,41.12 13.34,41.12 13.77,41.12 U6.3
  Top 0.406: 33.26,91.29 RN3.2
  Bottom 0.305: v22.86,89.38 CON7.2
  Bottom 0.406: v21.59,44.93 18.39,41.73 CON6.1
MSCLK
  Top 0.203: IC1.134 91.31,60.17 86.36,60.17 85.72,59.54 85.22,59.54 | RN2.1 34.6,54.13 34.92,54.46
  Top 0.254: 85.22,59.54 81.92,59.54 81.28,58.9 76.33,58.9 73.15,55.73 43.81,55.73 42.55,54.46 34.92,54.46 34.59,54.8 IC7.5
MSCLK-5V  (via drill 0.3)
  Top 0.203: 34.85,89.45 CON7.4
  Top 0.305: IC7.19 35.23,76.99 36.2,77.95 36.2,88.11 CON7.4 | v34.85,92.56 34.85,89.45 | v19.05,49.38 19.68,50.01 19.68,92.56 v20.95,93.83 | U6.5 16.73,44.31 14.61,46.43 CON6.8
  Top 0.406: v34.85,92.56 RN3.4
  Bottom 0.305: v20.95,93.83 33.66,93.83 34.92,92.56 v34.85,92.56
  Bottom 0.406: CON6.8 16.1,46.43 v19.05,49.38
MSDAT
  Top 0.203: IC1.130 91.59,62.71 85.72,62.71 | IC7.4 33.94,54.1 33.8,53.97 RN2.2
  Top 0.254: IC7.4 33.94,58.29 34.29,58.65 70.99,58.65 73.79,61.44 80.26,61.44 80.9,62.08 84.71,62.08 85.34,62.71 85.72,62.71
MSDAT-5V  (via drill 0.3)
  Top 0.203: v34.05,91.29 34.05,90.42 33.66,90.02 33.66,88.75 34.92,87.48 CON7.3
  Top 0.305: CON7.3 34.92,77.95 34.59,77.61 IC7.20 | v22.23,91.92 20.95,90.65 20.95,49.38 20.32,48.74 v20.32,46.84 | U6.1 13.77,44.93 12.06,44.93 11.46,44.33 CON6.2
  Top 0.406: v34.05,91.29 RN3.3
  Bottom 0.305: v22.23,91.92 33.42,91.92 v34.05,91.29
  Bottom 0.406: CON6.2 17.81,44.33 v20.32,46.84
N$1
  Top 0.813: R8.1 R3.2
N$2
  Top 0.813: R9.1 R5.2
N$3
  Top 0.813: R10.1 R7.2
N$4
  Bottom 0.61: JP1.7 JP1.5 JP1.3 JP1.1 Q1.3
N$6
  Top 0.406: 48.94,68.11 C33.1 48.82,68.62 IC9.8
  Top 1.016: C33.1 C37.1
N$341
  Top 0.203: 120.62,36.06 120.63,36.04 120.65,36.04 | R14.2 120.62,36.06 | 120.62,36.06 120.51,36.17
  Top 0.61: LED1.A R14.2
PA0
  Top 0.203: IC2.1 73.84,43.76 74.74,43.76 86.41,55.43 86.41,56.33 87.49,57.41 88.41,57.41 IC1.142
PA1
  Top 0.203: IC2.2 74.29,42.41 75.19,42.41 88.58,55.81
  Top 0.254: 88.58,55.81 IC1.144
PA2
  Top 0.203: IC2.3 74.29,40.62 75.19,40.62 85.96,51.39 87.72,51.39 IC1.2
PA3
  Top 0.203: IC2.4 74.74,39.27 75.63,39.27 85.96,49.6 87.34,49.6 IC1.4
PA4
  Top 0.203: IC2.5 75.19,37.92 76.08,37.92 86.86,48.7 87.15,48.7 IC1.5
PA5
  Top 0.203: IC2.18 88.66,28.04 89.55,28.04 97.64,36.12 102.13,36.12 105,39 105,39.48 105,40.12 IC1.38
PA6
  Top 0.203: IC2.19 89.11,26.7 90,26.7 97.64,34.33 101.77,34.33 106.26,38.82 106.26,39.64 106.26,40.27 IC1.40
PA7
  Top 0.203: IC2.20 89.55,25.35 90.45,25.35 97.64,32.53 101.41,32.53 107.51,38.64 107.51,39.79 107.51,40.43 IC1.42
PA8
  Top 0.203: IC2.21 90,24 90.9,24 97.64,30.74 101.05,30.74 108.77,38.46 108.77,40.59 IC1.44
PA9
  Top 0.203: IC2.22 90.45,22.65 91.35,22.65 97.64,28.94 100.69,28.94 110.03,38.28 110.03,42.16 109.39,42.79 IC1.48
PA10
  Top 0.203: IC2.23 97.64,29.84 100.87,29.84 109.4,38.37 109.4,40.03 109.4,40.66 IC1.45
PA11
  Top 0.203: IC2.24 97.64,31.63 101.23,31.63 108.14,38.55 108.14,39.87 108.14,40.51 IC1.43
PA12
  Top 0.203: 101.59,33.43 106.89,38.73 106.89,39.72 106.89,40.35 IC1.41 | IC2.25 97.64,33.43
  Top 0.254: 97.64,33.43 101.59,33.43
PA13
  Top 0.203: IC2.26 97.64,35.23 101.95,35.23 105.63,38.91 105.63,39.56 105.63,40.19 IC1.39
PA14
  Top 0.203: IC2.27 97.64,37.02 102.13,37.02 104.37,39.27 104.37,39.4 104.37,40.04 IC1.37
PA15
  Top 0.203: IC2.42 85.96,52.29 87.91,52.29 IC1.1
PB/!PC!
  Top 0.203: IC2.43 87.31,55.43 87.31,56.33 87.85,56.87 88.25,56.87 IC1.143
PCLK  (via drill 0.3)
  Top 0.254: IC1.20 95.31,46.26 94.61,45.57 94.36,45.31 v92.71,45.31
  Top 0.406: IC8.1 v104.78,25.25
  Bottom 0.406: v92.71,45.31 92.71,37.31 v104.78,25.25
PD0
  Top 0.203: IC2.7 79.23,38.37 79.23,39.27 88.66,48.7 88.66,49.5 IC1.6
PD1
  Top 0.203: IC2.8 80.57,37.92 80.57,38.82 90,48.25 90.94,48.25 IC1.11
PD2
  Top 0.203: IC2.9 81.92,37.47 81.92,38.37 90,46.45 90.56,46.45 IC1.13
PD3
  Top 0.203: IC2.10 83.27,37.02 83.27,37.92 90,44.66 90.18,44.66 IC1.15
PD4
  Top 0.203: IC2.13 85.96,34.33 85.96,35.23 90,39.27 90,39.53 IC1.22
PD5
  Top 0.203: IC2.14 86.86,33.43 87.76,33.43 92.7,38.37 92.7,38.69 IC1.27
PD6
  Top 0.203: IC1.29 94.49,39.07 94.49,38.37 88.21,32.08 87.31,32.08 IC2.15
PD7
  Top 0.203: IC1.31 96.29,39.45 96.29,38.37 88.66,30.74 87.76,30.74 IC2.16
PD8
  Top 0.203: IC1.30 95.39,39.26 95.39,38.37 IC2.29
PD9
  Top 0.203: IC2.30 93.59,38.37 93.59,38.88 IC1.28
PD10
  Top 0.203: IC2.31 91.8,38.37 91.8,39.91 IC1.24
PD11
  Top 0.203: 90.9,39.72 90.9,39.27 IC2.32 | 90.9,39.72 IC1.23 | 90.9,39.72
PD12
  Top 0.203: 85.03,38.8 IC1.16
  Top 0.254: IC2.35 85.03,38.8
PD13
  Top 0.203: IC2.36 90,45.55 90.37,45.55 IC1.14
PD14
  Top 0.203: IC2.37 90,47.35 90.75,47.35 IC1.12
PD15
  Top 0.203: IC2.38 89.55,48.7 89.55,49.69 IC1.7
PIXCLK
  Top 0.203: 92.71,68.43 93.6,68.43 94.23,67.79 95.12,67.79 96.77,66.14 97.36,66.14 IC1.117
  Top 0.305: 92.71,68.43 88.72,68.43 88.09,69.06 70.48,69.06 60.96,78.59 CON3.12
R0
  Top 0.203: 98.42,73.25 99.69,71.98 99.69,69.46 IC1.109
  Top 0.305: 98.42,73.25 97.16,74.52 97.16,75.41 88.9,83.67 R2.1
R1
  Top 0.203: IC1.110 99.06,69.39 99.06,71.09 97.66,72.49
  Top 0.305: R3.1 88.9,81.64 95.76,74.78 95.76,74.4 97.66,72.49
RED  (via drill 0.3)
  Top 0.254: IC9.5 52.9,70.52 53.98,69.44 v55.24,69.44
  Top 0.813: R2.2 R8.2 78.93,81.76 v73.66,81.76
  Bottom 0.406: CON2.1 54.66,68.86 v55.24,69.44 63.5,69.44 73.66,79.6 v73.66,81.76 CON3.2
SCL
  Top 0.203: 111.12,42.48 IC1.50
  Top 0.254: 111.12,42.48 111.76,41.84 111.76,41.76 111.76,37.31 104.78,30.33 IC8.8 104.78,26.52 102.23,23.98 R12.1
SDA
  Top 0.203: IC1.51 110.01,44.3 110.49,44.3 112.39,42.39
  Top 0.254: R11.1 105.41,24.61 106.05,25.25 IC8.7 106.05,29.69 113.03,36.68 113.03,41.76 112.39,42.39
SKBRX
  Top 0.203: IC1.133 91.38,60.81 86.11,60.81 85.47,60.17 85.09,60.17
  Top 0.254: 85.09,60.17 81.66,60.17 81.03,59.54 76.07,59.54 72.9,56.36 43.18,56.36 41.91,55.09 35.56,55.09 35.23,55.42 IC7.6
SKBRX-5V  (via drill 0.3)
  Top 0.305: CON7.5 v37.47,82.4 37.47,77.95 35.88,76.37 IC7.18 | v27.3,22.07 27.3,81.13 v28.57,82.4 | U7.4 16.37,20.79 14.25,18.67 CON5.6
  Bottom 0.305: v28.57,82.4 v37.47,82.4
  Bottom 0.406: v27.3,22.07 23.91,18.67 CON5.6
SKBTX
  Top 0.203: IC1.132 91.45,61.44 85.85,61.44 85.22,60.81 84.84,60.81
  Top 0.254: 84.84,60.81 81.41,60.81 80.77,60.17 75.82,60.17 72.64,57 42.55,57 41.27,55.73 36.2,55.73 35.88,56.04 IC7.7
SKBTX-5V  (via drill 0.3)
  Top 0.305: CON7.7 v40.01,84.94 40.01,79.22 36.53,75.75 IC7.17 | v24.13,28.42 24.77,29.06 24.77,83.67 v26.04,84.94 | CON5.5 9.8,24.23 12.45,24.23 14.59,22.09 U7.1
  Bottom 0.203: CON5.5 8.56,25.56
  Bottom 0.305: v26.04,84.94 v40.01,84.94
  Bottom 0.406: 8.56,25.56 10.16,27.15 22.86,27.15 v24.13,28.42
SMSRX
  Top 0.203: IC1.131 91.52,62.08 86.23,62.08
  Top 0.254: 86.23,62.08 85.6,62.08 84.96,61.44 81.15,61.44 80.52,60.81 75.56,60.81 72.39,57.63 41.91,57.63 40.64,56.36 36.83,56.36 36.53,56.66 IC7.8
SMSRX-5V  (via drill 0.3)
  Top 0.254: CON5.4 11.08,20.79
  Top 0.305: IC7.16 37.19,75.13 41.27,79.22 v41.27,83.67 41.27,88.11 CON7.10 | v25.4,23.34 26.04,23.98 26.04,82.4 v27.3,83.67 | 11.08,20.79 U7.3
  Bottom 0.305: v27.3,83.67 v41.27,83.67
  Bottom 0.406: v25.4,23.34 22.83,20.77 CON5.4
STATUS
  Top 0.203: IC1.59 112.39,47.57 112.39,45.57 113.03,44.93
  Top 0.254: 113.03,44.93 119.41,38.55 R14.1
TCK  (via drill 0.3)
  Top 0.254: IC1.35 102.69,43.03 v103.5,43.03 | CON1.1 116.84,8.74 127,8.74 128.27,10.01 128.27,14.45 126.36,16.36 v126.36,29.06
  Bottom 0.254: v103.5,43.03 109.22,37.31 118.11,37.31 v126.36,29.06 | RN1.2 113.27,11.04 114.3,10.01 CON1.1
TDI  (via drill 0.3)
  Top 0.254: CON1.9 127,11.28 127,14.45 125.73,15.72 v125.73,28.42 | IC1.34 101.6,42.64 v101.6,43.66
  Bottom 0.254: v125.73,28.42 118.11,36.04 109.22,36.04 v101.6,43.66 | RN1.1 113.73,11.84 114.3,11.28 124.46,11.28 CON1.9
TDO  (via drill 0.3)
  Top 0.254: IC1.36 101.6,39.98 v101.6,39.85 | v124.46,27.15 124.46,16.99 121.92,14.45 120.65,14.45 119.38,13.18 119.38,11.28 CON1.3
  Bottom 0.254: v101.6,39.85 102.87,39.85 109.22,33.5 118.11,33.5 v124.46,27.15 | RN1.3 112.8,10.24 114.3,8.74 116.84,8.74 CON1.3
TMS  (via drill 0.3)
  Top 0.254: IC1.33 100.97,42.72 v100.97,43.03 | v125.09,27.79 125.09,16.36 121.92,13.18 121.92,11.28 CON1.5
  Bottom 0.254: v100.97,43.03 109.22,34.77 118.11,34.77 v125.09,27.79 | RN1.4 112.33,9.44 114.3,7.47 118.11,7.47 CON1.5
VCC  (via drill 0.3)
  Top 0.203: 31.97,63.4 IC7.24 29.95,63.41
  Top 0.254: RN3.8 RN3.7 RN3.6 RN3.5 | 141.98,81.11 C19.1
  Top 0.305: 139.78,79.31 IC4.24 141.98,81.11
  Top 0.406: IC9.1 IC9.2
  Top 0.813: EXP1.C3 EXP1.B3 EXP1.A3
  Top 1.016: EXP1.A32 EXP1.B32 EXP1.C32
  Bottom 0.61: C41.1 v53.98,92.56
  other vias: 111.76,83.03 113.03,83.03 112.39,81.76 113.67,81.76 111.76,80.49 113.03,80.49 110.49,80.49 109.22,80.49 114.3,83.03 114.94,81.76 114.3,80.49 115.57,83.03 116.2,81.76 115.57,80.49 116.84,80.49 117.47,81.76 116.84,83.03 112.39,79.22 111.12,79.22 109.86,79.22 113.67,79.22 114.94,79.22 116.2,79.22 107.95,80.49 108.58,79.22 112.39,84.3 113.67,84.3 114.94,84.3 116.2,84.3 113.03,85.57 114.3,85.57 115.57,85.57 117.47,84.3 116.84,85.57 118.11,83.03 118.11,80.49 117.47,79.22 118.11,85.57 118.75,84.3 118.75,81.76
  pour Top (isolate 0.305, rank 6): 0,100.18 0,-0.15 160.66,-0.15 160.66,100.18
  pour Bottom (isolate 0.406, no thermals): 119.38,84.94 117.47,86.84 116.2,86.84 115.57,87.48 113.67,87.48 109.86,83.67 106.68,83.67 106.68,80.24 108.33,78.59 118.75,78.59 119.38,79.22
VCCINT  (via drill 0.3)
  Top 0.254: IC1.90 108.97,60.62 108.97,60.55 | IC1.19 96.08,47.73 96.39,47.73 96.52,47.85 | IC1.56 109.23,48.62 109.22,48.62 | IC1.126 95.95,61.19 96.01,61.19
  Top 0.406: 108.97,60.55 106.43,58.02 v106.43,57.54 | 96.52,47.85 98.35,49.68 v98.35,51.25 | 109.22,48.62 107.48,50.35 v105.53,50.35 | 96.01,61.19 98.77,58.43 v99.25,58.43
  Bottom 1.016: v106.43,57.54 105.27,56.38 C8.2 | v99.25,58.43 100.4,57.28 C11.2 | v98.35,51.25 99.5,52.41 C2.2 | v105.53,50.35 104.38,51.51 C5.2
  Bottom 1.676: 100.94,86.59 IC3.3
  pour Bottom (isolate 0.406, rank 5, no thermals): 102.39,59.78 98.52,55.92 98.52,55.63 arc90 98.55,55.6 99.95,54.2 98.68,52.93 100.97,50.65 101.22,50.65 103,52.43 104.14,51.28 104.67,51.28 107.47,54.09 107.78,54.39
  pour Bottom (isolate 0.406, rank 2, no thermals): 84.33,88.62 93.85,88.62 94.36,89.13 105.16,89.13 106.05,88.11 106.05,80.49 108.58,77.95 118.75,77.95 119.38,77.32 119.38,63.98 114.94,59.54 109.22,59.54 107.31,57.63 107.31,55.09 103.5,58.9 106.05,58.9 107.95,60.81 107.95,64.62 102.87,69.7 102.87,71.6 101.47,71.6 100.2,70.33 85.72,70.33 83.82,72.24 83.82,88.11
VS  (via drill 0.3)
  Top 0.203: 92.71,66.65 94.73,66.65 IC1.120
  Top 0.305: 92.71,66.65 84.2,66.65 v83.82,67.03 66.17,67.03 60.77,72.43 IC9.15
  Bottom 0.305: v83.82,67.03 R15.2
VS-TTL  (via drill 0.3)
  Top 0.254: IC9.16 57.98,73.06 v59.69,74.78
  Top 0.305: v46.99,83.03 52.07,88.11 54.61,88.11 58.42,91.92 62.87,91.92 64.77,90.02 64.77,88.11 CON3.8 | v6.99,81.76 6.35,81.13 6.35,75.34 8.26,73.43 CON2.13
  Bottom 0.305: v46.99,83.03 45.72,81.76 41.27,81.76 40.64,81.13 27.3,81.13 26.67,81.76 v6.99,81.76
  Bottom 0.406: v59.69,74.78 66.04,81.13 CON3.8
WS
  Top 0.203: IC1.96 109.36,65.25 110.49,65.25 111.12,65.89
  Top 0.254: 111.12,65.89 114.3,69.06 128.91,69.06 TP4.1
  Bottom 0.61: Q2.1 134.31,74.46 TP4.1 R13.1

## Text on the board
tNames: GND | Video out | CK | VS | HS | B | G | R | 1.8V CPLD Core | Keyboard & Mouse | VGA | WS (3.3V) | INT (3.3V) | 640x480 72-75 Hz | IRQ3 | Altera | IRQ4 | 5BM570ZT144 | IRQ | IRQ2 | CON7 | 1: PS/2 Kbd clock | 2: PS/2 Kbd data | Sun kbd/mouse | 3: PS/2 Mouse data | 4: PS/2 Mouse clock | 5: Sun Kbd Receive | 6: Do not connect | 7: Sun Kbd Transmit | 8: +5V DC | 9: GND | 10: Sun Mouse Receive | GND | 3V3 | GND | PS/2 kbd/mouse | (c) 2012-2013 AlexiosC | JTAG | INT (3.3V) | TCK | TDO | TMS | TDI | 1337 | CFT Minicomputer Video Display Unit rev F
bNames: 1.8V DC | www.bedroomlan.org/cft | (c) 2012-2013 AlexiosC | 1337 | CFT Minicomputer Video Display Unit rev F